# EAGLE design SwitchSignal (EAGLE 5.11)
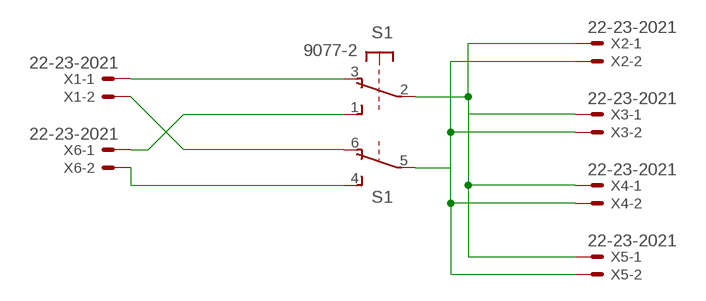
[diagram p0: schematic, sheet 1]

## Parts
S1  9077-2  [9077-2]
X1  22-23-2021  [22-23-2021]
X2  22-23-2021  [22-23-2021]
X3  22-23-2021  [22-23-2021]
X4  22-23-2021  [22-23-2021]
X5  22-23-2021  [22-23-2021]
X6  22-23-2021  [22-23-2021]

## Nets
N$1: S1.3(1:O) X1.1
N$2: S1.6(2:O) X1.2
N$3: S1.1(1:S) X6.1
N$4: S1.4(2:S) X6.2
N$5: S1.2(1:P) X2.1 X3.1 X4.1 X5.1
RECT: S1.5(2:P) X2.2 X3.2 X4.2 X5.2

## Library data of the parts
S1 = switch-misc:9077-2: MARQUARDT SWITCH 9077.0200 Distributor: Buerklin <https://www.buerklin.com/default.asp?event=ShowArtikel%2812G2822%29&l=d&jump=ArtNr_12G2822>
X1-X6 = con-molex:22-23-2021: .100" (2.54mm) Center Header - 2 Pin; MF: MOLEX; MPN: 22-23-2021; OC_FARNELL: 1462926; OC_NEWARK: 25C3832

## Net classes
0 default: width 0.762 mm

## Board
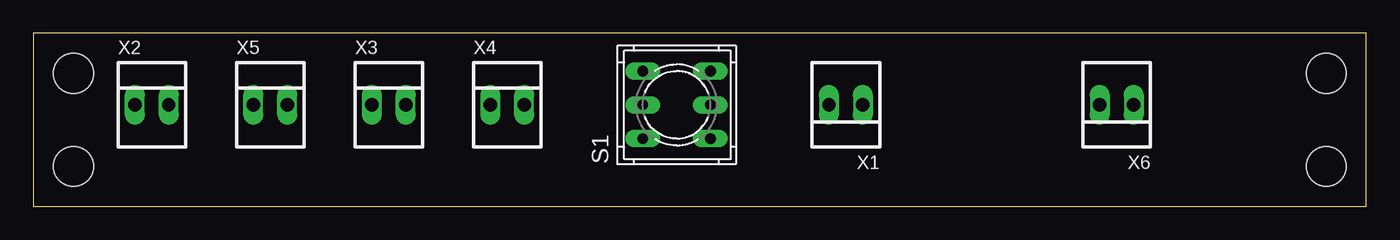
[diagram p1: board, top side]
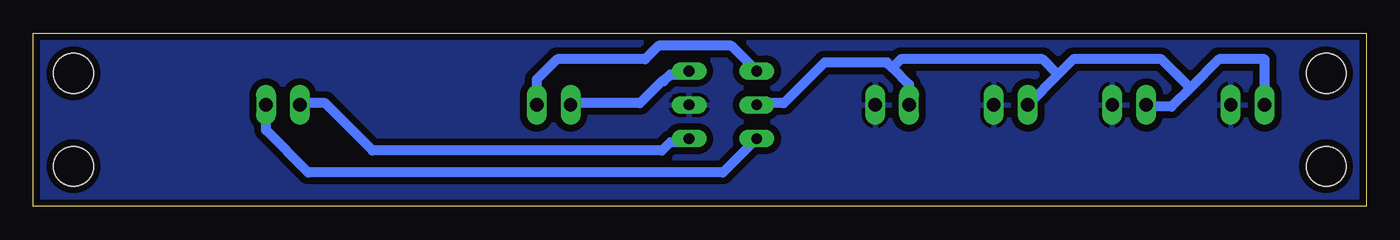
[diagram p2: board, bottom side, seen from below]

Size 100 x 13 mm. Coordinates in mm from the lower left corner, seen from the top.
Outline: 0,0 100,0 100,13 0,13 0,0
Copper layers (1*16): Top 0.035mm / dielectric 1.5mm / Bottom 0.035mm
Design rules "default *": minimum track width 10mil, minimum drill 24mil, track to track 20mil, track to pad 20mil, pad to pad 20mil, via to via 20mil, smd to smd 20mil, copper to edge 20mil, drill to drill 20mil, minimum pad ring 10mil, minimum via ring 8mil, stop-mask expansion 4mil, vias tented up to drill 0mil, thermal gap 10mil
Holes 3 mm at 3,3 3,10 97,10 97,3

### Footprints (pad centres in the part's own frame; a part is rotated, then mirrored left to right if it is on the bottom)
9077-2 = drill 0.813 long: 1 -2.54,2.54; 2 0,2.54; 3 2.54,2.54; 4 -2.54,-2.54; 5 0,-2.54; 6 2.54,-2.54
22-23-2021 = drill 1 long: 1 -1.27,0; 2 1.27,0

### Placement (x,y rotation side)
S1  48.26,7.62 90 top
X1  60.96,7.62 180 top
X2  8.89,7.62 0 top
X3  26.67,7.62 0 top
X4  35.56,7.62 0 top
X5  17.78,7.62 0 top
X6  81.28,7.62 180 top

### Tracks (layer width: path | path; a pad name or v marks a point on that pad's centre or on a via)
N$1
  Bottom 0.762: S1.3 47.62,12.06 53.09,12.06 54.1,11.05 60.71,11.05 62.23,9.53 X1.1
N$2
  Bottom 0.762: S1.6 51.05,9.91 52.2,9.91 52.7,9.4 52.83,9.4 54.48,7.75 59.56,7.75 X1.2
N$3
  Bottom 0.762: S1.1 48.26,2.54 79.38,2.54 82.55,5.71 X6.1
N$4
  Bottom 0.762: S1.4 51.05,4.83 52.2,4.83 52.83,4.19 74.55,4.19 78.11,7.75 79.88,7.75 X6.2
N$5
  Bottom 0.762: S1.2 45.59,7.75 43.69,7.75 40.64,10.79 35.94,10.79 35.56,10.41 | 35.56,10.41 34.29,9.14 X4.1 | X2.1 7.62,11.05 11.05,11.05 13.21,8.89 | 13.21,8.89 14.61,7.49 16.38,7.49 X5.1 | 23.11,9.91 21.97,11.05 15.37,11.05 13.21,8.89 | 23.11,9.91 X3.1 | 35.56,10.41 34.92,11.05 24.26,11.05 23.11,9.91
RECT
  pour Bottom: -1.27,15.24 0,0 100.33,0 100.33,15.24